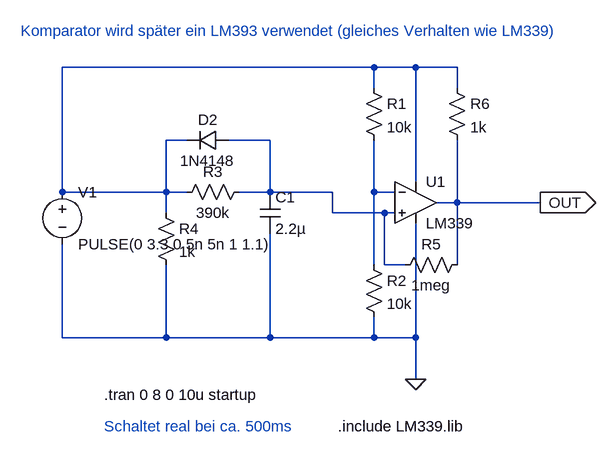
[diagram p0: schematic trigger.asc]
trigger.asc, the LTspice schematic file:
Version 4
SHEET 1 880 680
WIRE 112 -80 -368 -80
WIRE 176 -80 112 -80
WIRE 240 -80 176 -80
WIRE 112 -48 112 -80
WIRE 240 -48 240 -80
WIRE -176 32 -208 32
WIRE -48 32 -112 32
WIRE 176 96 176 -80
WIRE -368 112 -368 -80
WIRE -208 112 -208 32
WIRE -208 112 -368 112
WIRE -176 112 -208 112
WIRE -48 112 -48 32
WIRE -48 112 -96 112
WIRE 48 112 -48 112
WIRE 112 112 112 32
WIRE 144 112 112 112
WIRE 240 128 240 32
WIRE 240 128 208 128
WIRE 368 128 240 128
WIRE -208 144 -208 112
WIRE 48 144 48 112
WIRE 128 144 48 144
WIRE 144 144 128 144
WIRE 112 224 112 112
WIRE 128 224 128 144
WIRE 160 224 128 224
WIRE 240 224 240 128
WIRE -368 336 -368 192
WIRE -208 336 -208 224
WIRE -208 336 -368 336
WIRE -48 336 -48 176
WIRE -48 336 -208 336
WIRE 112 336 112 304
WIRE 112 336 -48 336
WIRE 176 336 176 160
WIRE 176 336 112 336
WIRE 176 400 176 336
FLAG 176 400 0
FLAG 368 128 OUT
IOPIN 368 128 Out
SYMBOL voltage -368 96 R0
WINDOW 123 0 0 Left 2
WINDOW 39 0 0 Left 2
SYMATTR InstName V1
SYMATTR Value PULSE(0 3.3 0 5n 5n 1 1.1)
SYMBOL res -80 96 R90
WINDOW 0 0 56 VBottom 2
WINDOW 3 32 56 VTop 2
SYMATTR InstName R3
SYMATTR Value 390k
SYMBOL cap -64 112 R0
SYMATTR InstName C1
SYMATTR Value 2.2µ
SYMBOL diode -112 16 R90
WINDOW 0 0 32 VBottom 2
WINDOW 3 32 32 VTop 2
SYMATTR InstName D2
SYMATTR Value 1N4148
SYMBOL res -224 128 R0
SYMATTR InstName R4
SYMATTR Value 1k
SYMBOL Opamps\\opamp2 176 64 R0
SYMATTR InstName U1
SYMATTR Value LM339
SYMBOL res 96 -64 R0
SYMATTR InstName R1
SYMATTR Value 10k
SYMBOL res 96 208 R0
SYMATTR InstName R2
SYMATTR Value 10k
SYMBOL res 256 208 R90
WINDOW 0 0 56 VBottom 2
WINDOW 3 32 56 VTop 2
SYMATTR InstName R5
SYMATTR Value 1meg
SYMBOL res 224 -64 R0
SYMATTR InstName R6
SYMATTR Value 1k
TEXT -304 424 Left 2 !.tran 0 8 0 10u startup
TEXT -304 472 Left 2 ;Schaltet real bei ca. 500ms
TEXT 56 472 Left 2 !.include LM339.lib
TEXT -432 -136 Left 2 ;Komparator wird später ein LM393 verwendet (gleiches Verhalten wie LM339)

The netlist it stands for:
* trigger.asc
V1 N001 0 PULSE(0 3.3 0 5n 5n 1 1.1)
R3 N002 N001 390k
C1 N002 0 2.2µ
D2 N002 N001 1N4148
R4 N001 0 1k
XU1 N002 N003 N001 0 OUT LM339  ; pins In+ In- V+ V- OUT
R1 N001 N003 10k
R2 N003 0 10k
R5 OUT N002 1meg
R6 N001 OUT 1k
.model D D
.lib standard.dio
.tran 0 8 0 10u startup
* Schaltet real bei ca. 500ms
.include LM339.lib
* Komparator wird später ein LM393 verwendet (gleiches Verhalten wie LM339)
.backanno
.end